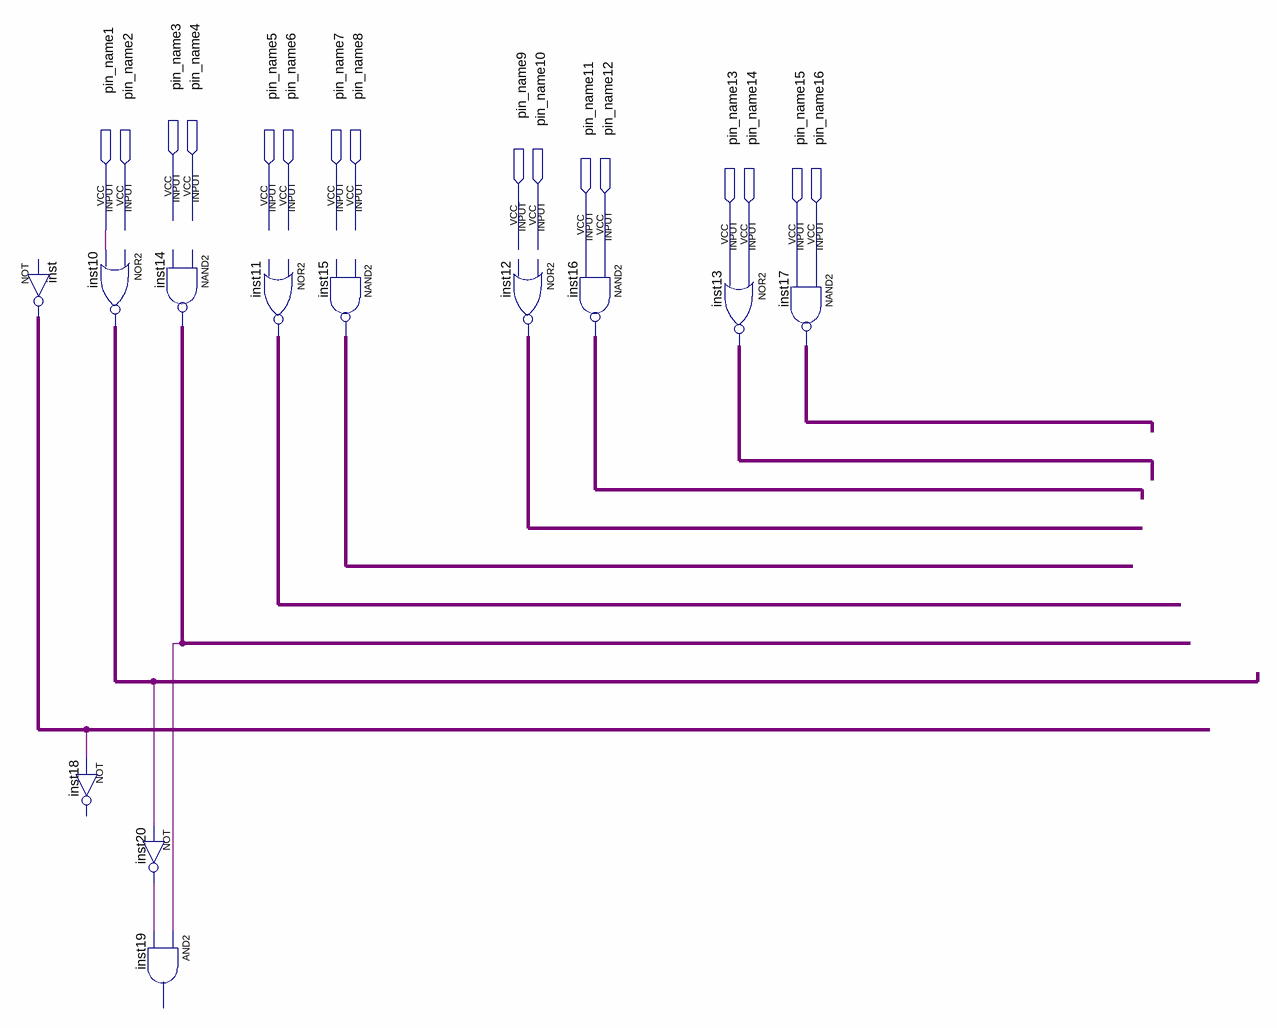
[diagram p0: schematic sheet]
// Quartus schematic cla.bdf as structural Verilog: 12 symbols, 16 pins
module cla (
  input  pin_name3,
  input  pin_name4,
  input  pin_name1,
  input  pin_name2,
  input  pin_name5,
  input  pin_name6,
  input  pin_name7,
  input  pin_name8,
  input  pin_name9,
  input  pin_name10,
  input  pin_name11,
  input  pin_name12,
  input  pin_name13,
  input  pin_name14,
  input  pin_name15,
  input  pin_name16
);

  wire inst10_out, inst11_out, inst12_out, inst13_out, inst14_out, inst15_out, inst16_out, inst17_out,
       inst20_out, inst_out;

  not inst10 (inst10_out, pin_name1);  // NOR2 open: IN1
  // NOT inst has open pins: IN=open, OUT=inst_out
  // NOT inst18 has open pins: IN=inst_out, OUT=open
  // NAND2 inst14 has open pins: IN1=open, IN2=open, OUT=inst14_out
  not inst20 (inst20_out, inst10_out);
  // AND2 inst19 has open pins: IN1=inst14_out, IN2=inst20_out, OUT=open
  // NOR2 inst11 has open pins: IN1=open, IN2=open, OUT=inst11_out
  // NAND2 inst15 has open pins: IN1=open, IN2=open, OUT=inst15_out
  // NOR2 inst12 has open pins: IN1=open, IN2=open, OUT=inst12_out
  nand inst16 (inst16_out, pin_name12, pin_name11);
  nor inst13 (inst13_out, pin_name14, pin_name13);
  nand inst17 (inst17_out, pin_name16, pin_name15);
endmodule
